# Altium schematic sheet USB.SchDoc: USB
size A4; DocumentNumber: MB1137; Revision: B-01; SheetNumber: 4; SheetTotal: 6; Project: NUCLEO-XXXXZX
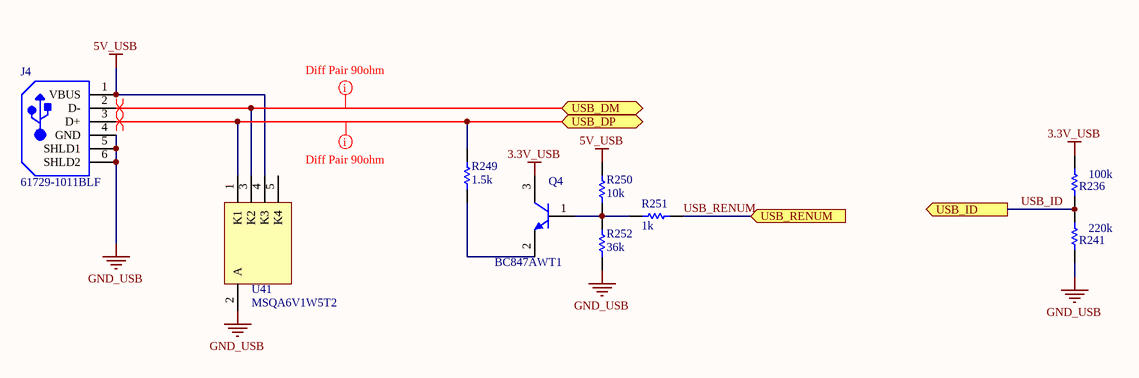
[diagram p0: USB.SchDoc]

## Parts
J4  61729-1011BLF  [FCI-61729-1011BLF_V]
Q4  BC847AWT1  [ONSC-SC-70-3-419-04_V]
R236  value 100k  [RESC0402(1005)_L]  (hidden comment: RES0402)
R241  value 220k  [RESC0402(1005)_L]  (hidden comment: RES0402)
R249  value 1.5k  [RESC0402(1005)_L]  (hidden comment: RES0402)
R250  value 10k  [RESC0402(1005)_L]  (hidden comment: RES0402)
R251  value 1k  [RESC0402(1005)_L]  (hidden comment: RES0402)
R252  value 36k  [RESC0402(1005)_L]  (hidden comment: RES0402)
U41  MSQA6V1W5T2  [ONSC-SC70-5-419A-02_V]

## Ports
USB_DM (bidir), USB_DP (bidir), USB_ID (out), USB_RENUM (in)

## Nets
3.3V_USB: Q4.3(C) R236.2
5V_USB: J4.1(VBUS) R250.1 U41.4(K3)
GND_USB: J4.4(GND) J4.5(SHLD1) J4.6(SHLD2) R241.1 R252.2 U41.2(A)
USB_DM: J4.2(D-) U41.3(K2) ; port USB_DM
USB_DP: J4.3(D+) R249.1 U41.1(K1) ; port USB_DP
USB_ID: R236.1 R241.2 ; port USB_ID
USB_RENUM: R251.2 ; port USB_RENUM
NetQ4_1: Q4.1(B) R250.2 R251.1 R252.1
NetQ4_2: Q4.2(E) R249.2

Not connected (* = marked no-connect by the designer): U41 5(K4)

## Layout directives
differential pair: (no net found under the mark)
mark named Diff Pair 90ohm: USB_DM, USB_DP

## Notes on the sheet
- Title:
- Project:
- Size:
- Date:
- A4
- Reference:
- Sheet:
- Revision:
- of

## Library data of the parts
J4 = CMP-1698-00004-1: USB Receptacle B Type, Right Angle, -40 to 85 degC, 4-Pin THD, RoHS, Tube; Voltage Rating (DC): 100 V; Case\Package: Radial; Capacitance: 22 uF; Tolerance: 20%; ComponentLink2Description: Datasheet; Lead Pitch: 2.5 mm; Packaging: Bulk; REACH SVHC: No SVHC; Length: 11.2 mm; Pins: 2; Radiation Hardening: No; RoHSCompliant: true; ComponentLink1Description: Manufacturer URL; Voltage Rating: 100 V; Min Operating Temperature: -40 degC; PackageDescription: 4-Pin Through Hole Device, Body 16 x 12.2 mm; Height: 11.2 mm; PackageReference: 61729-1011BLF; Package Quantity: 200; ComponentLink2URL: http://portal.fciconnect.com/Comergent/fci/drawing/61729.pdf; DatasheetVersion: Rev. W, 05/2014; Max Operating Temperature: 85 degC; Diameter: 6.3 mm; ComponentLink1URL: http://portal.fciconnect.com/; Mount: Through Hole
Q4 = CMP-1048-00334-1: General Purpose Transistor, NPN Silicon, 3-Pin SC70, Tape and Reel; Manufacturer: On Semiconductor; Note1: 0; fT Min (MHz): 100; IC Continuous (A): 0.1; PackageDescription: 3-Pin Small Outline Transistor, Body 2 x 1.25 mm, Pitch 0.65 mm; ComponentLink1Description: Manufacturer URL; ComponentLink2Description: Datasheet; ComponentLink1URL: http://www.onsemi.com/; ComponentLink2URL: http://www.onsemi.cn/pub_link/Collateral/BC846AWT1-D.PDF; Packing: Tape and Reel; DatasheetVersion: Rev. 9; Mounting Technology: Surface Mount; PartNumber: BC847AWT1; PackageVersion: Rev. N, 11/2008; RoHS: FALSE; ComponentLink3URL: http://www.onsemi.cn/pub_link/Collateral/419-04.PDF; Polarity: NPN; PackageReference: SC-70-3-419-04; ComponentLink3Description: Package Specification
R236 R241 R249-R252 = CMP-1591-00004-1: 0402 (1005 Metric) Chip Resistor; Case-EIA: 0402; Case-Metric: 1005; PackageReference: RESC0402(1005)
U41 = CMP-1060-00060-1: Quad Array ESD Protection Diodes with Low Clamping Voltage, 5-Pin SC70, Tape and Reel; Manufacturer: On Semiconductor; P Max (W): 0.385; Packing: Tape and Reel; DatasheetVersion: Rev. 7; ComponentLink2URL: http://www.onsemi.com/pub_link/Collateral/MSQA6V1W5T2-D.PDF; PackageDescription: 5-Pin Small Outline Transistor, Body 2 x 1.25 mm, Pitch 0.65 mm; PackageVersion: Rev. L, 01/2013; ComponentLink1URL: http://www.onsemi.com/; ComponentLink2Description: Datasheet; ComponentLink3Description: Package Specification; Mounting Technology: Surface Mount; ComponentLink1Description: Manufacturer URL; PackageReference: SC70-5-419A-02; PartNumber: MSQA6V1W5T2; ComponentLink3URL: http://www.onsemi.cn/pub_link/Collateral/419A-02.PDF